# Altium project GaugeMaster.PrjPcb
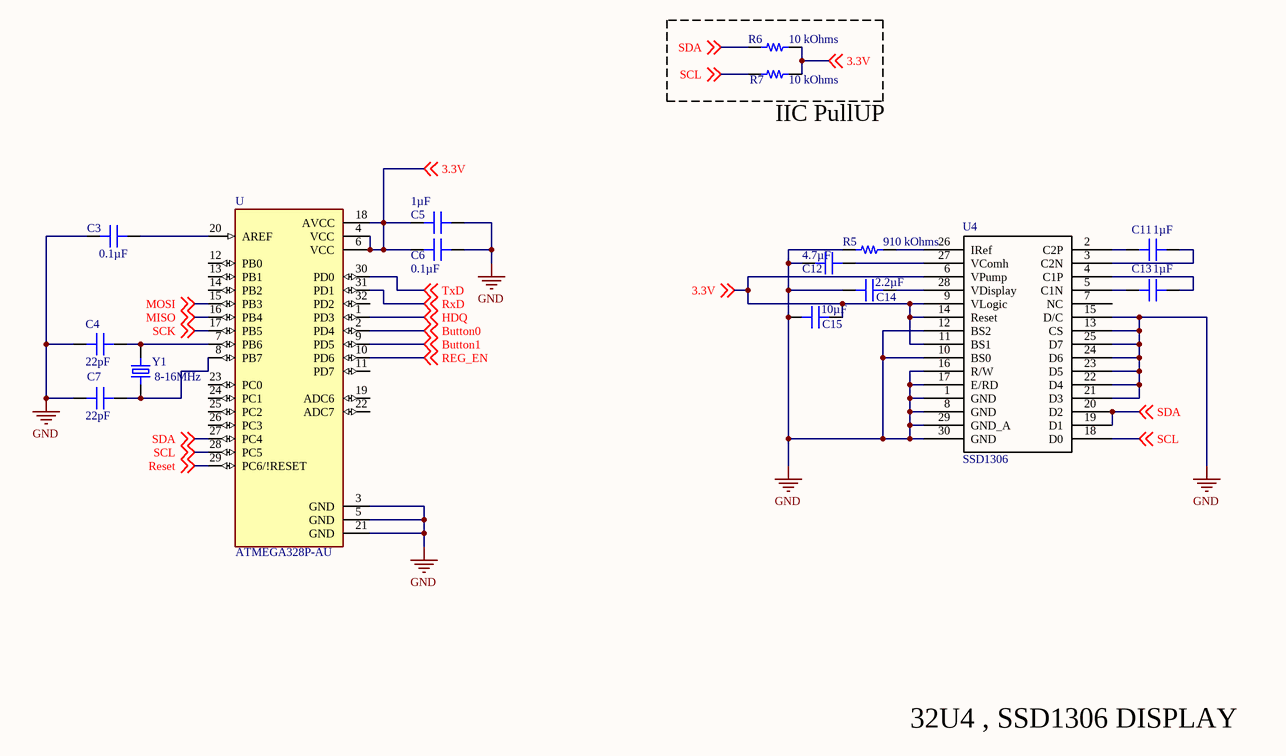
[diagram p0: Sheet2.SchDoc]
1 sheet, 16 parts. Net scope: global (net labels, ports and power ports of the same name join across sheets).
Board file: PCB1.PcbDoc

## Sheet Sheet2.SchDoc
size A4

### Parts
C3  0.1µF  [CAP 0402_1005]
C4  22pF  [CAP 0402_1005]
C5  1µF  [CAP 0402_1005]
C6  0.1µF  [CAP 0402_1005]
C7  22pF  [CAP 0402_1005]
C11  1µF  [CAP 0402_1005]
C12  4.7µF  [CAP 0402_1005]
C13  1µF  [CAP 0402_1005]
C14  2.2µF  [CAP 0402_1005]
C15  10µF  [CAP 0402_1005]
R5  910 kOhms  [RES 0402_1005]
R6  10 kOhms  [RES 0402_1005]
R7  10 kOhms  [RES 0402_1005]
U  ATMEGA328P-AU  [QFP80P900X900X120-32N]
U4  SSD1306  [PCBComponent_1]
Y1  8-16MHz  [XTAL_ECS-80-18-4XDN]

### Nets
GND: C3.2 C4.2 C5.1 C6.2 C7.2 C12.1 C14.1 C15.1 R5.2 U.3(GND) U.5(GND) U.21(GND) U4.1(GND) U4.8(GND) U4.10(BS0) U4.12(BS2) U4.13(CS) U4.15(D/C) U4.16(R/W) U4.17(E/RD) U4.21(D3) U4.22(D4) U4.23(D5) U4.24(D6) U4.25(D7) U4.29(GND_A) U4.30(GND)
3.3V: C5.2 C6.1 C15.2 R6.1 R7.1 U.4(VCC) U.6(VCC) U.18(AVCC) U4.6(VPump) U4.9(VLogic) U4.11(BS1) U4.14(Reset) ; off-sheet 3.3V
Button0: U.2(PD4) ; off-sheet Button0
Button1: U.9(PD5) ; off-sheet Button1
HDQ: U.1(PD3) ; off-sheet HDQ
MISO: U.16(PB4) ; off-sheet MISO
MOSI: U.15(PB3) ; off-sheet MOSI
REG_EN: U.10(PD6) ; off-sheet REG_EN
Reset: U.29(PC6/!RESET) ; off-sheet Reset
RxD: U.31(PD1) ; off-sheet RxD
SCK: U.17(PB5) ; off-sheet SCK
SCL: R7.2 U.28(PC5) U4.18(D0) ; off-sheet SCL
SDA: R6.2 U.27(PC4) U4.19(D1) U4.20(D2) ; off-sheet SDA
TxD: U.30(PD0) ; off-sheet TxD
NetC3_1: C3.1 U.20(AREF)
NetC4_1: C4.1 U.7(PB6) Y1.2
NetC7_1: C7.1 U.8(PB7) Y1.1
NetC11_1: C11.1 U4.2(C2P)
NetC11_2: C11.2 U4.3(C2N)
NetC12_2: C12.2 U4.27(VComh)
NetC13_1: C13.1 U4.5(C1N)
NetC13_2: C13.2 U4.4(C1P)
NetC14_2: C14.2 U4.28(VDisplay)
NetR5_1: R5.1 U4.26(IRef)

Not connected (* = marked no-connect by the designer): U 11(PD7) 12(PB0) 13(PB1) 14(PB2) 19(ADC6) 22(ADC7) 23(PC0) 24(PC1) 25(PC2) 26(PC3) 32(PD2); U4 7(NC)

### Notes on the sheet
- (near R7) IIC PullUP
- 32U4 , SSD1306 DISPLAY

### Library data of the parts
C3-C7 C11-C14 = CL05A106MP8NUB8: CAP CER 10UF 10V X5R 0402; Manufacturer: Samsung Electro-Mechanics; Capacitance: 10µF; Tolerance: ±20%; Part Number: CL05A106MP8NUB8; Applications: General Purpose; ComponentLink1Description: Datasheet; ComponentLink1URL: http://www.samsungsem.com/kr/support/product-search/mlcc/CL05A106MP8NUB8.jsp; ComponentLink2Description: DigiKey Link; ComponentLink2URL: http://digikey.com/product-detail/en/samsung-electro-mechanics/CL05A106MP8NUB8/1276-6830-1-ND/5961689; Device Package: 0402 (1005 Metric); LastUpdated: 19.01.2020 16:07:13; Lifecycle Status: Active; Minimum Order: 1; Mounting Type: Surface Mount, MLCC; Operating Temperature: -55°C ~ 85°C; Package / Case: 0402 (1005 Metric); Packaging: TapeAndReel; PartId: 1758; Part Status: Active; Price: 0.08; Series: CL; Size / Dimension: 0.039" L x 0.020" W (1.00mm x 0.50mm); Supplier 1: DigiKey; Supplier Part Number 1: 1276-6830-1-ND; Temperature Coefficient: X5R; Thickness (Max): 0.035" (0.90mm); Voltage - Rated: 10V
  C3 C6: Value: 0.1µF
  C4 C7: Value: 22pF
  C5 C11 C13: Value: 1µF
  C12: Value: 4.7µF
  C14: Value: 2.2µF
C15 = CL05A106MP8NUB8: CAP CER 10UF 10V X5R 0402; Manufacturer: Samsung Electro-Mechanics; Tolerance: ±20%; Part Number: CL05A106MP8NUB8; Value: 10µF; Applications: General Purpose; Capacitance: 10µF; ComponentLink1Description: Datasheet; ComponentLink1URL: http://www.samsungsem.com/kr/support/product-search/mlcc/CL05A106MP8NUB8.jsp; ComponentLink2Description: DigiKey Link; ComponentLink2URL: http://digikey.com/product-detail/en/samsung-electro-mechanics/CL05A106MP8NUB8/1276-6830-1-ND/5961689; Device Package: 0402 (1005 Metric); LastUpdated: 19.01.2020 16:07:13; Lifecycle Status: Active; Minimum Order: 1; Mounting Type: Surface Mount, MLCC; Operating Temperature: -55°C ~ 85°C; Package / Case: 0402 (1005 Metric); Packaging: TapeAndReel; PartId: 1758; Part Status: Active; Price: 0.08; Series: CL; Size / Dimension: 0.039" L x 0.020" W (1.00mm x 0.50mm); Supplier 1: DigiKey; Supplier Part Number 1: 1276-6830-1-ND; Temperature Coefficient: X5R; Thickness (Max): 0.035" (0.90mm); Voltage - Rated: 10V
R5-R7 = RP73PF1E10KBTD: RES 10K OHM 0.1% 1/10W 0402; Manufacturer: TE Connectivity Passive Product; Power (Watts): 0.1W, 1/10W; Temperature Coefficient: ±25ppm/°C; Part Number: RP73PF1E10KBTD; ComponentLink1Description: Datasheet; ComponentLink1URL: https://www.te.com/commerce/DocumentDelivery/DDEController?Action=srchrtrv&DocNm=1773272&DocType=DS&DocLang=English; ComponentLink2Description: DigiKey Link; ComponentLink2URL: http://digikey.com/product-detail/en/te-connectivity-passive-product/RP73PF1E10KBTD/A127415CT-ND/8261381; Composition: Thin Film; Device Package: 0402 (1005 Metric); Height - Seated (Max): 0.014" (0.35mm); LastUpdated: 19.01.2020 16:11:48; Lifecycle Status: Active; Minimum Order: 1; Number of Terminations: 2; Operating Temperature: -55°C ~ 155°C; Package / Case: 0402 (1005 Metric); Packaging: TapeAndReel; PartId: 2434; Part Status: Active; Price: 0.08; Resistance: 10 kOhms; Series: RP73P, Holsworthy; Size / Dimension: 0.039" L x 0.020" W (1.00mm x 0.50mm); Supplier 1: DigiKey; Supplier Part Number 1: A127415CT-ND; Supplier Device Package: 0402; Tolerance: ±0.1%
  R5: Value: 910 kOhms
  R6 R7: Value: 10 kOhms
U = ATMEGA328P-AU: AVR AVRÂ® ATmega Microcontroller IC 8-Bit 20MHz 32KB _16K x 16_ FLASH 32-TQFP _7x7_; MF: Microchip Technology; MP: ATMEGA328P-AU; Availability: Unavailable; Package: TQFP-32 Microchip Technology; Value: *; Price: None; SnapEDA_Link: https://www.snapeda.com/parts/ATMEGA328P-AU/Microchip/view-part/4593405/?ref=snap
Y1 = ECS-80-18-4XDN: 8MHz Â±30ppm Crystal 18pF 80 Ohms HC-49/US; MF: ECS Inc.; Digi-Key_Part_Number: X1115-ND; Package: HC-49/US ECS International; Value: *; SnapEDA_Link: https://www.snapeda.com/parts/ECS-80-18-4XDN/ECS%20Inc./view-part/49558/?ref=snap; Digi-Key_Purchase_URL: https://www.digikey.in/product-detail/en/ecs-inc/ECS-80-18-4XDN/X1115-ND/827606?utm_source=snapeda&utm_medium=aggregator&utm_campaign=symbol; MP: ECS-80-18-4XDN